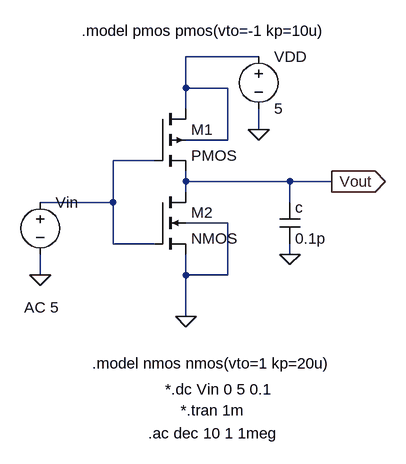
[diagram p0: schematic EXP 5 CMOS inverter.asc]
EXP 5 CMOS inverter.asc, the LTspice schematic file:
Version 4
SHEET 1 880 680
WIRE 288 -64 176 -64
WIRE 176 -16 176 -64
WIRE 240 -16 176 -16
WIRE 176 16 176 -16
WIRE 288 48 288 16
WIRE 240 64 240 -16
WIRE 240 64 176 64
WIRE 128 96 64 96
WIRE 176 128 176 112
WIRE 336 128 176 128
WIRE 400 128 336 128
WIRE 176 144 176 128
WIRE 64 160 64 96
WIRE 64 160 -48 160
WIRE 336 160 336 128
WIRE 240 192 176 192
WIRE 64 224 64 160
WIRE 128 224 64 224
WIRE 336 240 336 224
WIRE -48 272 -48 240
WIRE 176 272 176 240
WIRE 240 272 240 192
WIRE 240 272 176 272
WIRE 176 336 176 272
FLAG -48 272 0
FLAG 176 336 0
FLAG 336 240 0
FLAG 400 128 Vout
IOPIN 400 128 Out
FLAG 288 48 0
SYMBOL voltage -48 144 R0
WINDOW 3 -160 163 Left 2
WINDOW 123 -25 178 Left 2
WINDOW 39 0 0 Left 0
SYMATTR Value ""
SYMATTR Value2 AC 5
SYMATTR InstName Vin
SYMBOL cap 320 160 R0
SYMATTR InstName c
SYMATTR Value 0.1p
SYMBOL voltage 288 -80 R0
SYMATTR InstName VDD
SYMATTR Value 5
SYMBOL pmos4 128 16 R0
SYMATTR InstName M1
SYMATTR Value2 l=5u w=20u
SYMBOL nmos4 128 144 R0
SYMATTR InstName M2
SYMATTR Value2 l=5u w=10u
TEXT 32 408 Left 2 !.model nmos nmos(vto=1 kp=20u)
TEXT 16 -104 Left 2 !.model pmos pmos(vto=-1 kp=10u)
TEXT 144 448 Left 2 !*.dc Vin 0 5 0.1
TEXT 168 480 Left 2 !*.tran 1m
TEXT 118 516 Left 2 !.ac dec 10 1 1meg

The netlist it stands for:
* EXP 5 CMOS inverter.asc
Vin N002 0 AC 5
c Vout 0 0.1p
VDD N001 0 5
M1 N001 N002 Vout N001 PMOS l=5u w=20u
M2 Vout N002 0 0 NMOS l=5u w=10u
.model NMOS NMOS
.model PMOS PMOS
.lib standard.mos
.model nmos nmos(vto=1 kp=20u)
.model pmos pmos(vto=-1 kp=10u)
*.dc Vin 0 5 0.1
*.tran 1m
.ac dec 10 1 1meg
.backanno
.end